# EAGLE design RS08 (EAGLE 6.6.0)
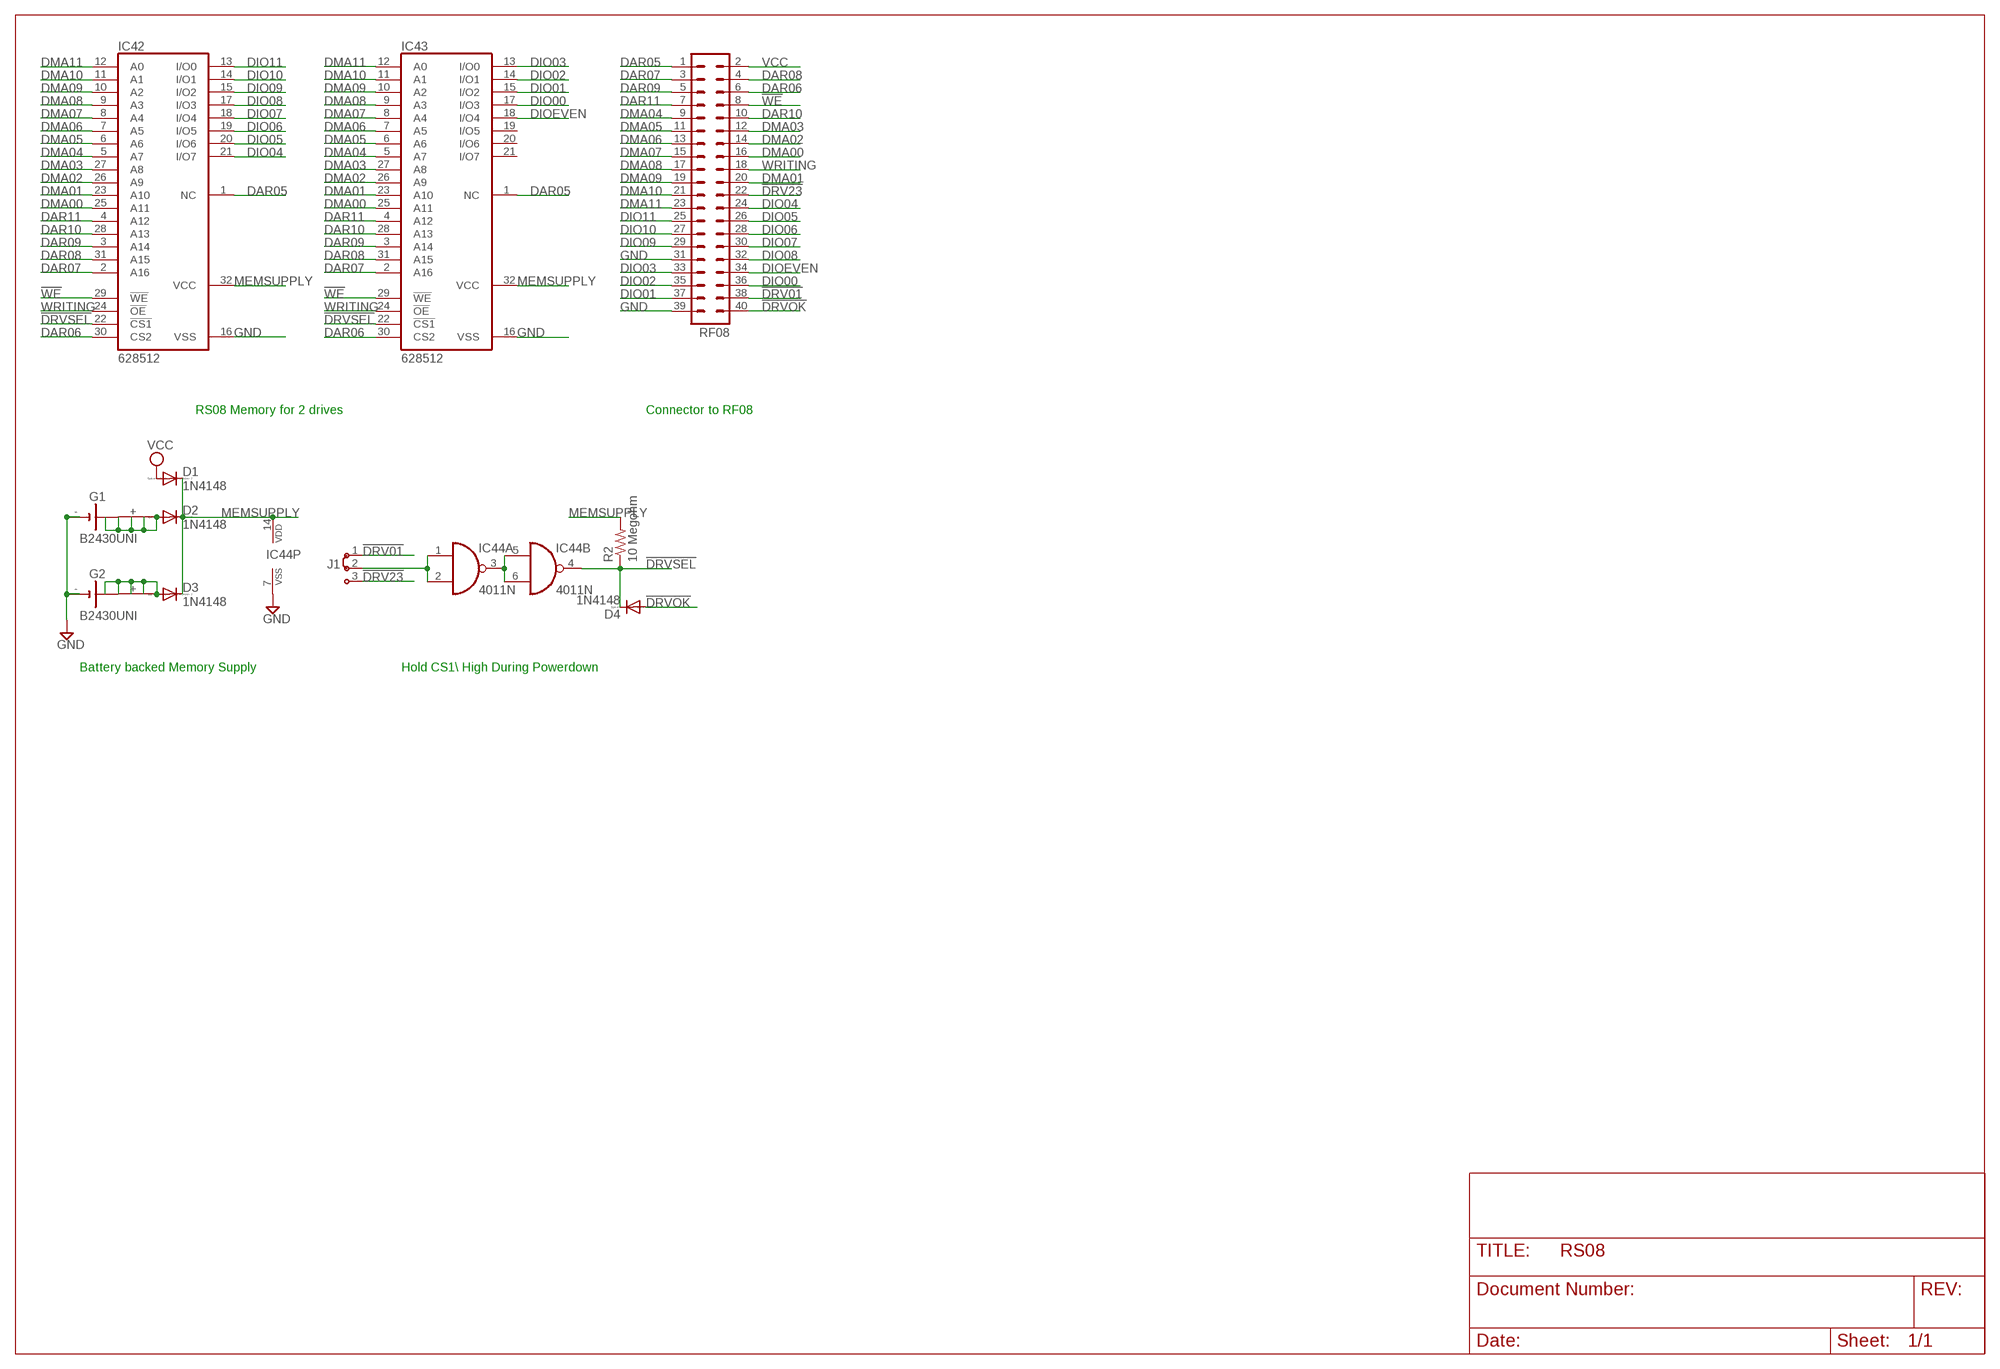
[diagram p0: schematic, sheet 1]

## Parts
D1  1N4148  1N4148DO35-10  [DO35-10]
D2  1N4148  1N4148DO35-10  [DO35-10]
D3  1N4148  1N4148DO35-10  [DO35-10]
D4  1N4148  1N4148DO35-10  [DO35-10]
G1  B2430UNI  [B2430UNI]
G2  B2430UNI  [B2430UNI]
IC42  628512  628128P  [DIL32]
IC43  628512  628128P  [DIL32]
IC44  4011N  [DIL14]
J1  J2X2MM  [04C]
R2  10 Megohm  R-US_0207/10  [0207/10]
RF08  MA20-2  [MA20-2]

## Nets
!DRV01: J1.1 RF08.38
!DRV23: J1.3 RF08.22
!DRVOK: D4.A RF08.40
!DRVSEL: D4.C IC42.22(!CS1) IC43.22(!CS1) IC44.4(B:O) R2.1
!WE: IC42.29(!WE) IC43.29(!WE) RF08.8
DAR05: IC42.1(NC) IC43.1(NC) RF08.1
DAR06: IC42.30(CS2) IC43.30(CS2) RF08.6
DAR07: IC42.2(A16) IC43.2(A16) RF08.3
DAR08: IC42.31(A15) IC43.31(A15) RF08.4
DAR09: IC42.3(A14) IC43.3(A14) RF08.5
DAR10: IC42.28(A13) IC43.28(A13) RF08.10
DAR11: IC42.4(A12) IC43.4(A12) RF08.7
DIO00: IC43.17(I/O3) RF08.36
DIO01: IC43.15(I/O2) RF08.37
DIO02: IC43.14(I/O1) RF08.35
DIO03: IC43.13(I/O0) RF08.33
DIO04: IC42.21(I/O7) RF08.24
DIO05: IC42.20(I/O6) RF08.26
DIO06: IC42.19(I/O5) RF08.28
DIO07: IC42.18(I/O4) RF08.30
DIO08: IC42.17(I/O3) RF08.32
DIO09: IC42.15(I/O2) RF08.29
DIO10: IC42.14(I/O1) RF08.27
DIO11: IC42.13(I/O0) RF08.25
DIOEVEN: IC43.18(I/O4) RF08.34
DMA00: IC42.25(A11) IC43.25(A11) RF08.16
DMA01: IC42.23(A10) IC43.23(A10) RF08.20
DMA02: IC42.26(A9) IC43.26(A9) RF08.14
DMA03: IC42.27(A8) IC43.27(A8) RF08.12
DMA04: IC42.5(A7) IC43.5(A7) RF08.9
DMA05: IC42.6(A6) IC43.6(A6) RF08.11
DMA06: IC42.7(A5) IC43.7(A5) RF08.13
DMA07: IC42.8(A4) IC43.8(A4) RF08.15
DMA08: IC42.9(A3) IC43.9(A3) RF08.17
DMA09: IC42.10(A2) IC43.10(A2) RF08.19
DMA10: IC42.11(A1) IC43.11(A1) RF08.21
DMA11: IC42.12(A0) IC43.12(A0) RF08.23
GND [Power]: G1.- G1.-@1(-) G2.- G2.-@1(-) IC42.16(VSS) IC43.16(VSS) IC44.7(P:VSS) RF08.31 RF08.39
MEMSUPPLY [Power]: D1.C D2.C D3.C IC42.32(VCC) IC43.32(VCC) IC44.14(P:VDD) R2.2
N$18: IC44.3(A:O) IC44.5(B:I0) IC44.6(B:I1)
N$35: IC44.1(A:I0) IC44.2(A:I1) J1.2
N$130: D3.A G2.+ G2.+@1(+) G2.+@2(+) G2.+@3(+) G2.+@4(+)
N$131: D2.A G1.+ G1.+@1(+) G1.+@2(+) G1.+@3(+) G1.+@4(+)
VCC [Power]: D1.A RF08.2
WRITING: IC42.24(!OE) IC43.24(!OE) RF08.18
Unconnected: IC43.19(I/O5) IC43.20(I/O6) IC43.21(I/O7) IC44.8(C:I0) IC44.9(C:I1) IC44.10(C:O) IC44.11(D:O) IC44.12(D:I0) IC44.13(D:I1)

## Notes on the sheet
- RS08 Memory for 2 drives | Connector to RF08
- Battery backed Memory Supply | Hold CS1\\ High During Powerdown

## Library data of the parts
D1-D4 = diode:1N4148: DIODE high speed (Philips)
G1 G2 = battery:B2430UNI: LI BATTERY
IC42 IC43 = memory-hitachi:628128P: MEMORY; OC_FARNELL: unknown; OC_NEWARK: unknown
IC44 = 40xx:4011: Quad 2-input NAND
J1 = jumper:J2: Jumper switch 2 x 2.5 mm
R2 = rcl:R-US_: RESISTOR, American symbol
RF08 = con-lstb:MA20-2: PIN HEADER; OC_FARNELL: unknown; OC_NEWARK: unknown

## Net classes
1 Power: width 0.508 mm

## Board
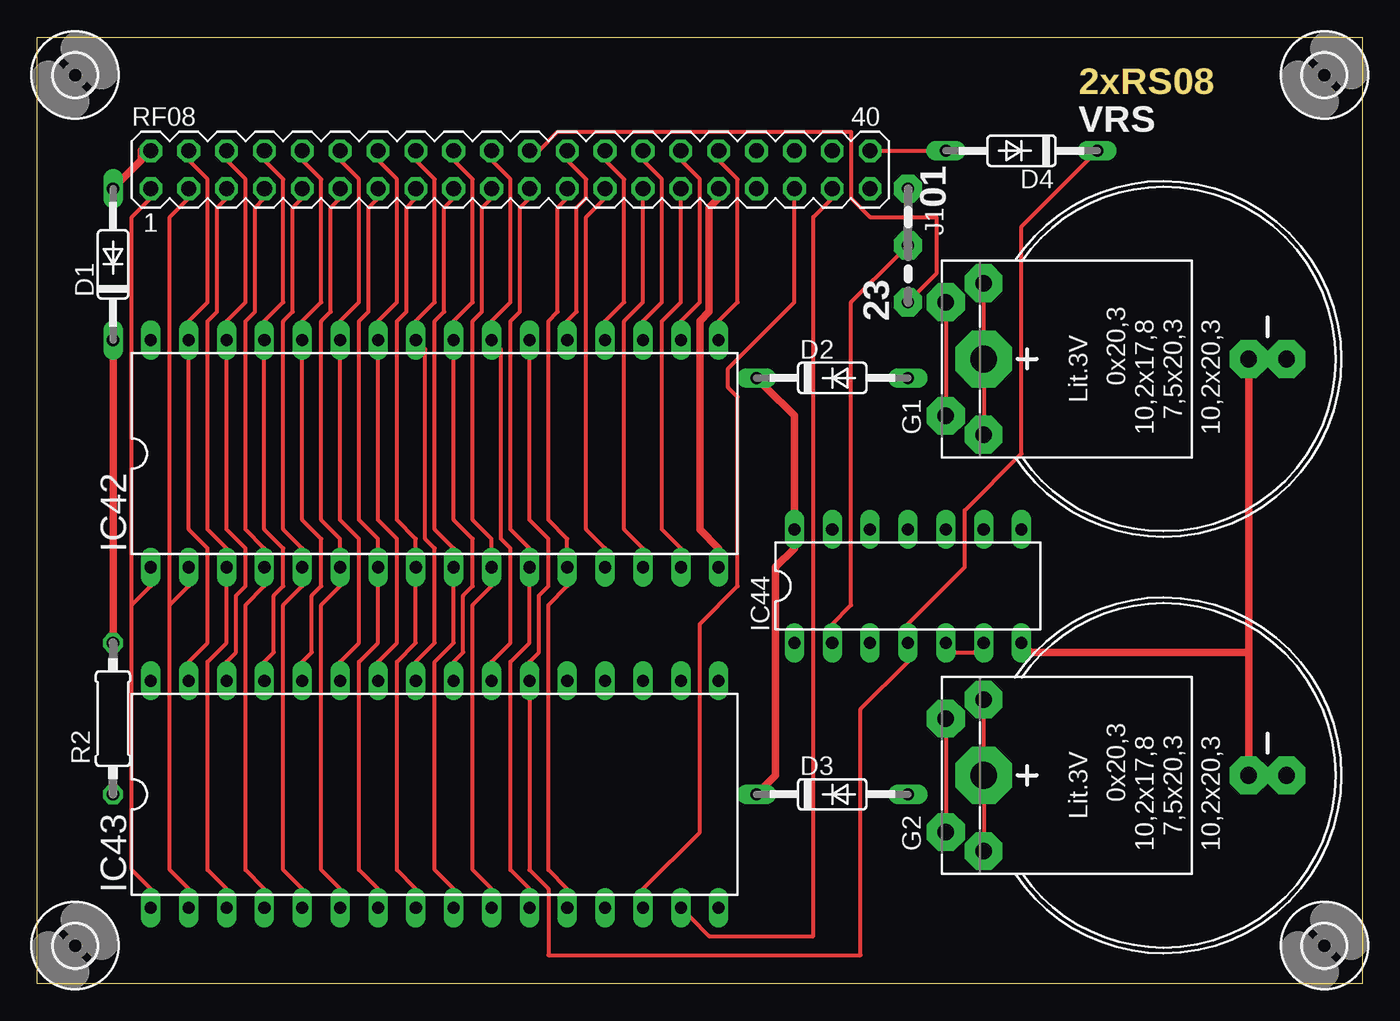
[diagram p1: board, top side]
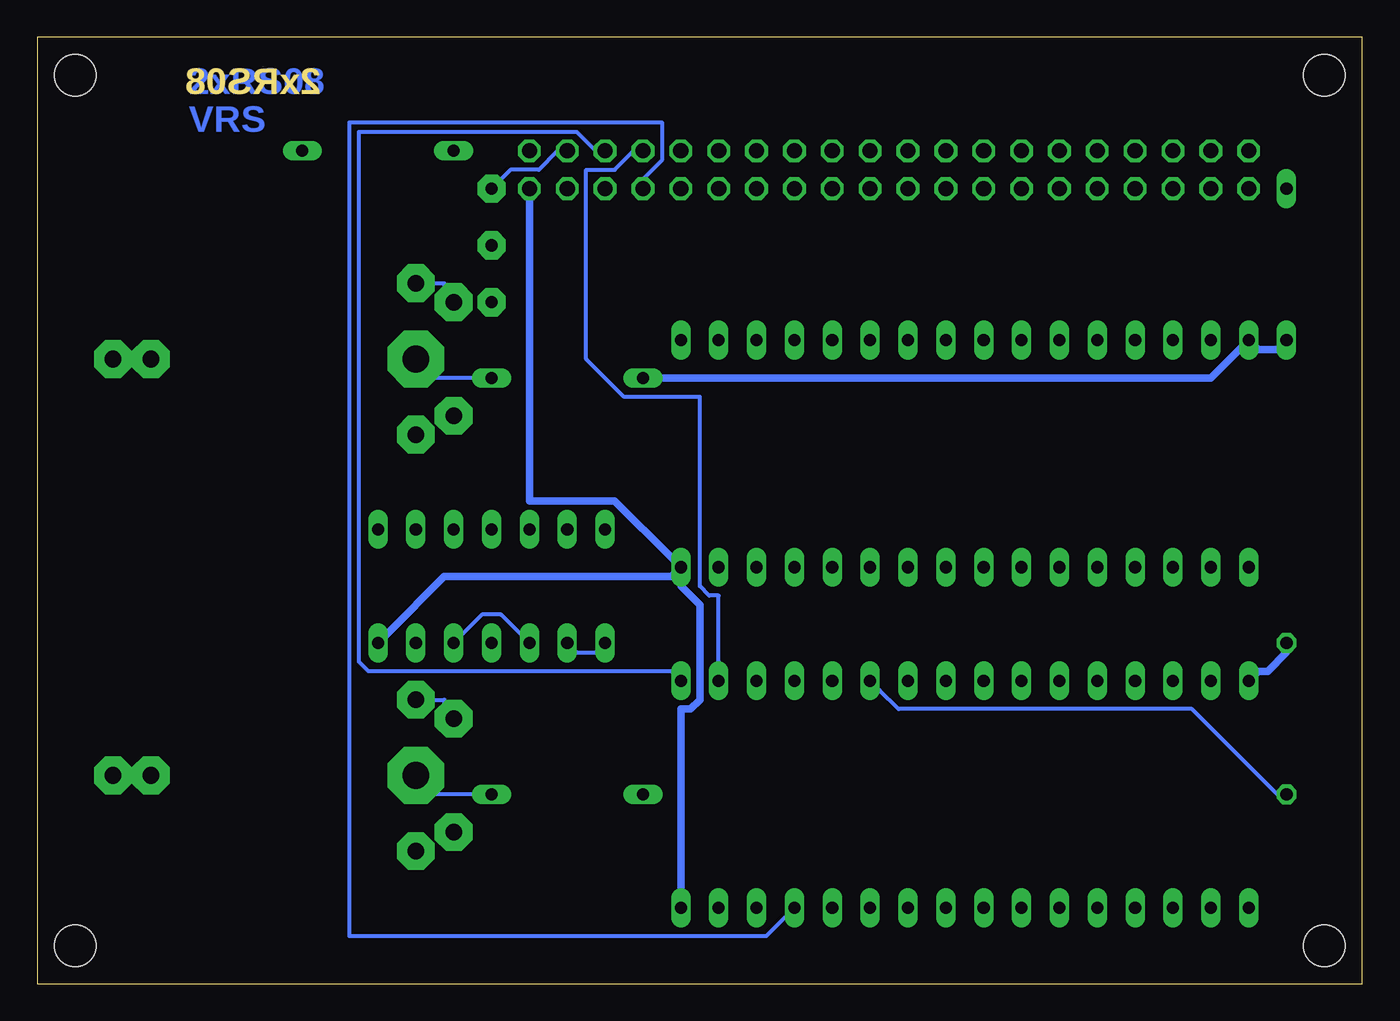
[diagram p2: board, bottom side, seen from below]

Size 88.9 x 63.5 mm. Coordinates in mm from the lower left corner, seen from the top.
Outline: 0,63.5 88.9,63.5 88.9,0 0,0 0,63.5
Copper layers (1*16): Top 0.035mm / dielectric 1.5mm / Bottom 0.035mm
Design rules "default": minimum track width 10mil, minimum drill 24mil, track to track 8mil, track to pad 8mil, pad to pad 8mil, via to via 8mil, smd to smd 8mil, copper to edge 40mil, drill to drill 8mil, minimum pad ring 10mil, minimum via ring 8mil, stop-mask expansion 4mil, vias tented up to drill 0mil, thermal gap 10mil

### Footprints (pad centres in the part's own frame; a part is rotated, then mirrored left to right if it is on the bottom)
DO35-10 = drill 0.813 long: A 5.08,0; C -5.08,0
B2430UNI = drill 1.118 pad 2.54 octagon: + 3.81,14.605; +@1 -3.81,14.605; +@2 -5.08,12.065; +@3 5.08,12.065; - 0,-5.715; -@1 0,-8.255 | drill 1.803 pad 3.81 octagon: +@4 0,12.065
DIL32 = drill 0.813 long: 1 -19.05,-7.62; 2 -16.51,-7.62; 3 -13.97,-7.62; 4 -11.43,-7.62; 5 -8.89,-7.62; 6 -6.35,-7.62; 7 -3.81,-7.62; 8 -1.27,-7.62; 9 1.27,-7.62; 10 3.81,-7.62; 11 6.35,-7.62; 12 8.89,-7.62; 13 11.43,-7.62; 14 13.97,-7.62; 15 16.51,-7.62; 16 19.05,-7.62; 17 19.05,7.62; 18 16.51,7.62; 19 13.97,7.62; 20 11.43,7.62; 21 8.89,7.62; 22 6.35,7.62; 23 3.81,7.62; 24 1.27,7.62; 25 -1.27,7.62; 26 -3.81,7.62; 27 -6.35,7.62; 28 -8.89,7.62; 29 -11.43,7.62; 30 -13.97,7.62; 31 -16.51,7.62; 32 -19.05,7.62
DIL14 = drill 0.813 long: 1 -7.62,-3.81; 2 -5.08,-3.81; 3 -2.54,-3.81; 4 0,-3.81; 5 2.54,-3.81; 6 5.08,-3.81; 7 7.62,-3.81; 8 7.62,3.81; 9 5.08,3.81; 10 2.54,3.81; 11 0,3.81; 12 -2.54,3.81; 13 -5.08,3.81; 14 -7.62,3.81
04C = drill 0.813 pad 1.905 octagon: 1 -1.905,0; 2 1.905,0; 3 5.715,0
0207/10 = drill 0.813 octagon: 1 -5.08,0; 2 5.08,0
MA20-2 = drill 1.016 octagon: 1 -24.13,-1.27; 2 -24.13,1.27; 3 -21.59,-1.27; 4 -21.59,1.27; 5 -19.05,-1.27; 6 -19.05,1.27; 7 -16.51,-1.27; 8 -16.51,1.27; 9 -13.97,-1.27; 10 -13.97,1.27; 11 -11.43,-1.27; 12 -11.43,1.27; 13 -8.89,-1.27; 14 -8.89,1.27; 15 -6.35,-1.27; 16 -6.35,1.27; 17 -3.81,-1.27; 18 -3.81,1.27; 19 -1.27,-1.27; 20 -1.27,1.27; 21 1.27,-1.27; 22 1.27,1.27; 23 3.81,-1.27; 24 3.81,1.27; 25 6.35,-1.27; 26 6.35,1.27; 27 8.89,-1.27; 28 8.89,1.27; 29 11.43,-1.27; 30 11.43,1.27; 31 13.97,-1.27; 32 13.97,1.27; 33 16.51,-1.27; 34 16.51,1.27; 35 19.05,-1.27; 36 19.05,1.27; 37 21.59,-1.27; 38 21.59,1.27; 39 24.13,-1.27; 40 24.13,1.27
2,8 = hole 2.8: 0,0

### Placement (x,y rotation side)
D1  5.08,48.26 90 top
D2  53.34,40.64 0 top
D3  53.34,12.7 0 top
D4  66.04,55.88 180 top
G1  75.56,41.91 90 top
G2  75.56,13.97 90 top
IC42  26.67,35.56 0 top
IC43  26.67,12.7 0 top
IC44  58.42,26.67 0 top
J1  58.42,51.44 270 top
R2  5.08,17.78 90 top
RF08  31.75,54.61 0 top
U$5  [2,8]  86.36,2.54 0 top
U$6  [2,8]  2.54,2.54 0 top
U$7  [2,8]  2.54,60.96 0 top
U$8  [2,8]  86.36,60.96 0 top

### Tracks (layer width: path | path; a pad name or v marks a point on that pad's centre or on a via)
!DRV01
  Bottom 0.254: RF08.38 53.98,55.88 55.24,54.61 57.15,54.61 57.78,53.98 J1.1
!DRV23
  Top 0.254: RF08.22 33.66,55.88 34.92,57.15 54.61,57.15 54.61,52.7 55.88,51.44 60.33,51.44 60.33,47.62 59.05,46.35 J1.3
!DRVOK
  Top 0.254: D4.A 59.69,55.88 56.52,55.88 RF08.40
!DRVSEL
  Top 0.254: IC42.22 33.02,41.91 33.02,31.11 34.29,29.84 34.29,26.67 33.66,26.04 33.66,22.23 33.02,21.59 IC43.22 33.02,19.05 33.02,7.62 34.29,6.35 34.29,1.91 55.24,1.91 55.24,18.41 58.42,21.59 IC44.4 58.42,24.13 62.23,27.94 62.23,31.75 66.04,35.56 66.04,50.8 70.48,55.24 D4.C
  Bottom 0.254: R2.1 5.71,12.7 11.43,18.41 31.11,18.41 32.38,19.68 IC43.22
!WE
  Top 0.254: IC43.29 15.24,21.59 15.88,22.23 15.88,26.04 16.51,26.67 16.51,29.21 15.24,30.48 15.24,41.91 IC42.29 15.24,44.45 16.51,45.72 16.51,53.98 15.24,55.24 RF08.8
DAR05
  Top 0.254: 6.35,25.4 6.35,7.62 7.62,6.35 IC43.1 | 6.35,25.4 7.62,26.67 IC42.1 | 6.35,25.4 6.35,51.44 7.62,52.7 RF08.1
DAR06
  Top 0.254: IC43.30 12.7,21.59 13.34,22.23 13.34,26.04 13.97,26.67 13.97,29.21 12.7,30.48 12.7,41.91 IC42.30 12.7,44.45 13.97,45.72 13.97,53.98 12.7,55.24 RF08.6
DAR07
  Top 0.254: 8.89,25.4 8.89,7.62 10.16,6.35 IC43.2 | 8.89,25.4 10.16,26.67 IC42.2 | 8.89,25.4 8.89,51.44 10.16,52.7 RF08.3
DAR08
  Top 0.254: IC43.31 10.16,21.59 11.43,22.86 11.43,29.21 10.16,30.48 10.16,41.91 IC42.31 10.16,44.45 11.43,45.72 11.43,53.98 10.16,55.24 RF08.4
DAR09
  Top 0.254: IC43.3 12.7,6.35 11.43,7.62 11.43,21.59 12.7,22.86 12.7,26.67 IC42.3 12.7,29.21 11.43,30.48 11.43,44.45 12.06,45.09 12.06,52.07 12.7,52.7 RF08.5
DAR10
  Top 0.254: IC43.28 17.78,21.59 18.41,22.23 18.41,26.04 19.05,26.67 19.05,29.84 17.78,31.11 17.78,41.91 IC42.28 17.78,44.45 19.05,45.72 19.05,53.98 17.78,55.24 RF08.10
DAR11
  Top 0.254: IC43.4 15.24,6.35 13.97,7.62 13.97,25.4 15.24,26.67 IC42.4 15.24,29.21 13.97,30.48 13.97,44.45 14.61,45.09 14.61,52.07 15.24,52.7 RF08.7
DIO00
  Bottom 0.254: IC43.17 46.35,20.95 66.67,20.95 67.31,21.59 67.31,57.15 52.7,57.15 51.44,55.88 RF08.36
DIO01
  Top 0.254: IC43.15 43.81,4.45 45.09,3.17 52.07,3.17 52.07,51.44 53.34,52.7 RF08.37
DIO02
  Top 0.254: IC43.14 40.64,6.35 44.45,10.16 44.45,24.13 46.99,26.67 46.99,39.37 46.35,40.01 46.35,41.27 50.8,45.72 50.8,52.7 RF08.35
DIO03
  Bottom 0.254: RF08.33 48.26,53.98 46.99,55.24 46.99,57.78 67.94,57.78 67.94,3.17 40.01,3.17 38.73,4.45 IC43.13
DIO04
  Top 0.254: IC42.21 35.56,44.45 36.2,45.09 36.2,52.07 36.83,52.7 36.83,53.98 35.56,55.24 RF08.24
DIO05
  Top 0.254: IC42.20 38.1,44.45 39.37,45.72 39.37,53.98 38.1,55.24 RF08.26
DIO06
  Top 0.254: IC42.19 40.64,44.45 41.91,45.72 41.91,53.98 40.64,55.24 RF08.28
DIO07
  Top 0.254: IC42.18 43.18,44.45 44.45,45.72 44.45,53.98 43.18,55.24 RF08.30
DIO08
  Top 0.254: IC42.17 45.72,44.45 46.99,45.72 46.99,53.98 45.72,55.24 RF08.32
DIO09
  Top 0.254: IC42.15 43.18,29.21 41.91,30.48 41.91,44.45 43.18,45.72 43.18,52.7 RF08.29
DIO10
  Top 0.254: IC42.14 40.64,29.21 39.37,30.48 39.37,44.45 40.64,45.72 40.64,52.7 RF08.27
DIO11
  Top 0.254: IC42.13 38.1,29.21 36.83,30.48 36.83,51.44 38.1,52.7 RF08.25
DIOEVEN
  Bottom 0.254: IC43.18 43.18,21.59 43.18,26.04 43.81,26.04 44.45,26.67 44.45,39.37 49.53,39.37 52.07,41.91 52.07,54.61 50.16,54.61 48.9,55.88 RF08.34
DMA00
  Top 0.254: IC43.25 25.4,21.59 26.67,22.86 26.67,29.21 26.04,29.84 26.04,42.55 IC42.25 25.4,44.45 26.67,45.72 26.67,53.98 25.4,55.24 RF08.16
DMA01
  Top 0.254: IC43.23 30.48,21.59 31.75,22.86 31.75,29.21 31.11,29.84 31.11,42.55 IC42.23 30.48,44.45 31.75,45.72 31.75,53.98 30.48,55.24 RF08.20
DMA02
  Top 0.254: IC43.26 22.86,21.59 24.13,22.86 24.13,29.84 22.86,31.11 22.86,41.91 IC42.26 22.86,44.45 24.13,45.72 24.13,53.98 22.86,55.24 RF08.14
DMA03
  Top 0.254: IC43.27 20.32,21.59 21.59,22.86 21.59,29.84 20.32,31.11 20.32,41.91 IC42.27 20.32,44.45 21.59,45.72 21.59,53.98 20.32,55.24 RF08.12
DMA04
  Top 0.254: IC43.5 17.78,6.35 16.51,7.62 16.51,25.4 17.78,26.67 IC42.5 17.78,29.21 16.51,30.48 16.51,44.45 17.14,45.09 17.14,52.07 17.78,52.7 RF08.9
DMA05
  Top 0.254: IC43.6 20.32,6.35 19.05,7.62 19.05,25.4 20.32,26.67 IC42.6 20.32,29.21 20.32,29.84 19.05,31.11 19.05,44.45 19.68,45.09 19.68,52.07 20.32,52.7 RF08.11
DMA06
  Top 0.254: IC43.7 22.86,6.35 21.59,7.62 21.59,21.59 22.86,22.86 22.86,26.67 IC42.7 22.86,29.21 22.86,29.84 21.59,31.11 21.59,44.45 22.23,45.09 22.23,52.07 22.86,52.7 RF08.13
DMA07
  Top 0.254: IC43.8 25.4,6.35 24.13,7.62 24.13,21.59 25.4,22.86 25.4,26.67 IC42.8 25.4,29.21 25.4,29.84 24.13,31.11 24.13,44.45 24.77,45.09 24.77,52.07 25.4,52.7 RF08.15
DMA08
  Top 0.254: IC43.9 27.94,6.35 26.67,7.62 26.67,21.59 27.94,22.86 27.94,26.67 IC42.9 27.94,29.21 26.67,30.48 26.67,44.45 27.3,45.09 27.3,52.07 27.94,52.7 RF08.17
DMA09
  Top 0.254: IC43.10 30.48,6.35 29.21,7.62 29.21,25.4 30.48,26.67 IC42.10 30.48,29.21 30.48,29.84 29.21,31.11 29.21,44.45 29.84,45.09 29.84,52.07 30.48,52.7 RF08.19
DMA10
  Top 0.254: IC43.11 33.02,6.35 31.75,7.62 31.75,21.59 33.02,22.86 33.02,26.67 IC42.11 33.02,29.21 31.75,30.48 31.75,44.45 32.38,45.09 32.38,52.07 33.02,52.7 RF08.21
DMA11
  Top 0.254: IC43.12 35.56,6.35 34.29,7.62 34.29,25.4 35.56,26.67 IC42.12 35.56,29.21 35.56,29.84 34.29,31.11 34.29,44.45 34.92,45.09 34.92,52.07 35.56,52.7 RF08.23
GND
  Top 0.508: 81.28,22.23 81.28,14.61 G2.- | 81.28,22.23 81.28,41.27 G1.- | 81.28,22.23 66.67,22.23 IC44.7 | RF08.31 45.72,52.7 45.09,52.07 45.09,45.09 44.45,44.45 44.45,30.48 45.72,29.21 IC42.16
  Bottom 0.508: G2.- 81.92,13.97 83.19,13.97 G2.-@1 | G1.- 81.92,41.91 83.19,41.91 G1.-@1 | IC44.7 65.41,23.5 61.59,27.3 46.35,27.3 IC42.16 | IC43.16 45.72,6.35 45.72,18.41 45.09,18.41 44.45,19.05 44.45,25.4 45.72,26.67 IC42.16 | RF08.39 55.88,52.7 55.88,32.38 50.16,32.38 46.35,28.57 IC42.16
MEMSUPPLY
  Top 0.508: D1.C 5.08,41.91 5.08,23.5 R2.2 | D3.C 48.9,13.34 49.53,13.97 49.53,27.94 50.8,29.21 IC44.14 50.8,31.75 50.8,38.1 48.9,40.01 D2.C
  Bottom 0.508: D1.C 5.71,42.55 6.99,42.55 IC42.32 8.26,42.55 10.16,40.64 46.99,40.64 D2.C | R2.2 5.08,22.23 6.35,20.95 6.99,20.95 IC43.32
N$18
  Top 0.254: IC44.6 62.87,22.23 61.59,22.23 IC44.5
  Bottom 0.254: IC44.3 56.52,23.5 57.78,24.77 59.05,24.77 60.33,23.5 IC44.5
N$35
  Top 0.254: IC44.2 53.34,24.13 54.61,25.4 54.61,45.72 57.78,48.9 J1.2
  Bottom 0.254: IC44.1 51.44,22.23 52.7,22.23 IC44.2
N$130
  Top 0.254: G2.+ 60.96,17.14 60.96,10.79 G2.+@1 | G2.+@2 63.5,9.53 63.5,12.7 G2.+@4 63.5,15.24 63.5,18.41 G2.+@3
  Bottom 0.254: D3.A 59.69,12.7 62.23,12.7 G2.+@4 | G2.+ 61.59,18.41 61.59,19.05 62.87,19.05 G2.+@3
N$131
  Top 0.254: G1.+ 60.96,45.09 60.96,38.73 G1.+@1 | G1.+@2 63.5,37.47 63.5,40.64 G1.+@4 63.5,43.18 63.5,46.35 G1.+@3
  Bottom 0.254: D2.A 59.69,40.64 62.23,40.64 G1.+@4 | G1.+ 61.59,46.35 61.59,46.99 62.87,46.99 G1.+@3
VCC
  Top 0.508: D1.A 5.71,53.98 6.99,55.24 6.99,55.88 RF08.2
WRITING
  Top 0.254: IC43.24 27.94,21.59 28.57,22.23 28.57,26.04 29.21,26.67 29.21,29.84 27.94,31.11 27.94,41.91 IC42.24 27.94,44.45 29.21,45.72 29.21,53.98 27.94,55.24 RF08.18

### Text on the board
Bottom: 2xRS08 | VRS
Dimension: 2xRS08
tPlace: VRS | 01 | 23